# EAGLE design jnode_v34 (EAGLE 6.6.0)
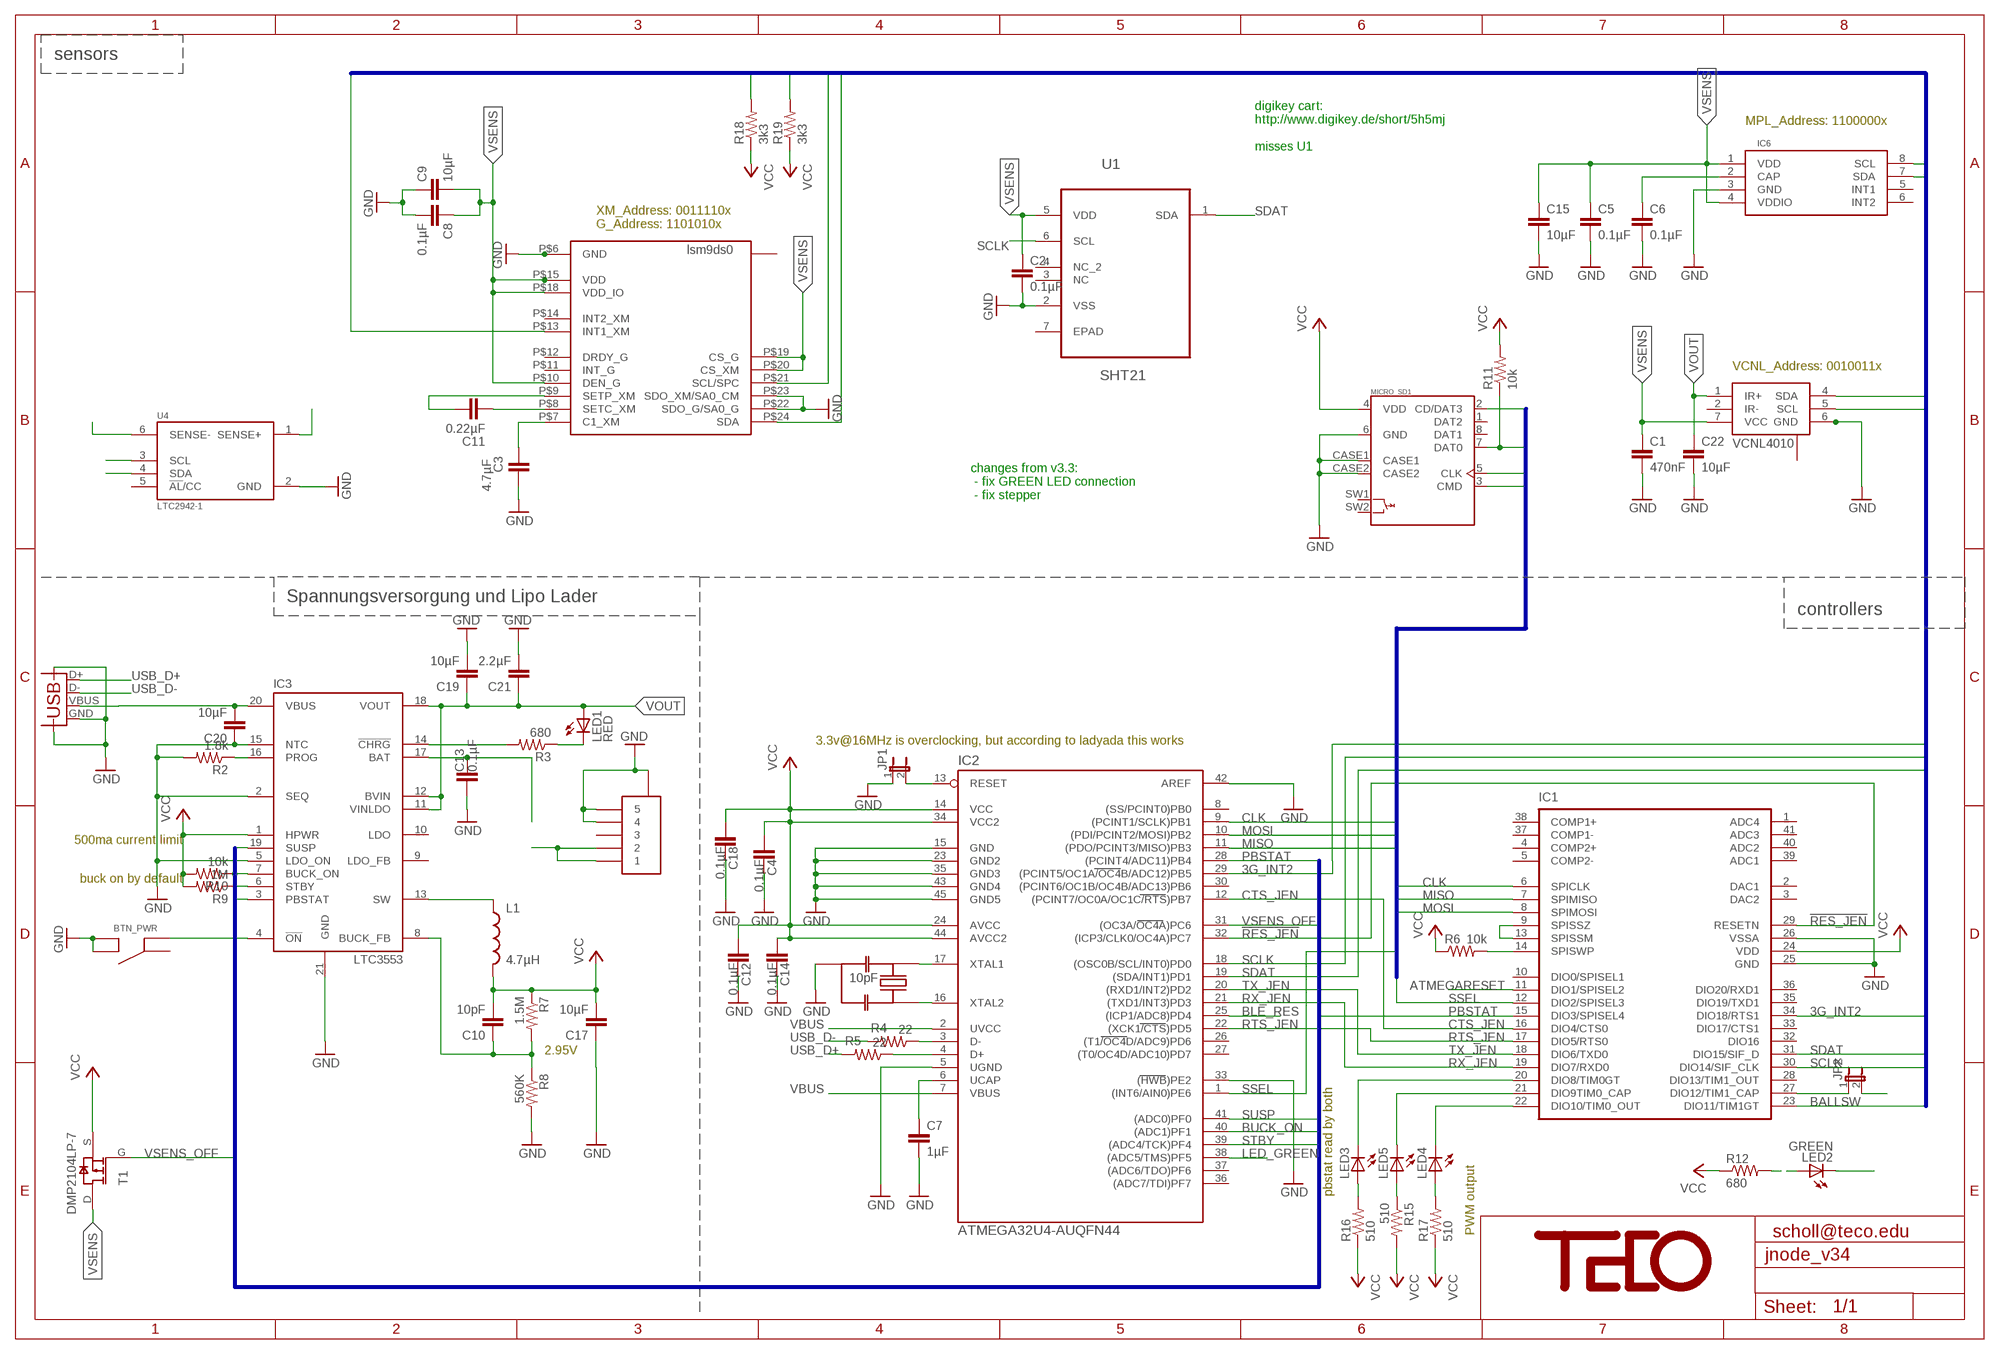
[diagram p0: schematic, sheet 1]

## Parts
BTN_PWR  TACTILE_SWITCH  [EVQ-PUK02K]
C1  470nF  CAP0402-CAP  [0402-CAP]
C2  0.1µF  CAP0402-CAP  [0402-CAP]
C3  4.7µF  CAP0402-CAP  [0402-CAP]
C4  0.1µF  CAP0402-CAP  [0402-CAP]
C5  0.1µF  CAP0402-CAP  [0402-CAP]
C6  0.1µF  CAP0402-CAP  [0402-CAP]
C7  1µF  CAP0402-CAP  [0402-CAP]
C8  0.1µF  CAP0402-CAP  [0402-CAP]
C9  10µF  CAP0603-CAP  [0603-CAP]
C10  10pF  CAP0402-CAP  [0402-CAP]
C11  0.22µF  CAP0402-CAP  [0402-CAP]
C12  0.1µF  CAP0402-CAP  [0402-CAP]
C13  0.1µF  CAP0402-CAP  [0402-CAP]
C14  0.1µF  CAP0402-CAP  [0402-CAP]
C15  10µF  CAP0603-CAP  [0603-CAP]
C17  10µF  CAP0603-CAP  [0603-CAP]
C18  0.1µF  CAP0402-CAP  [0402-CAP]
C19  10µF  CAP0603-CAP  [0603-CAP]
C20  10µF  CAP0603-CAP  [0603-CAP]
C21  2.2µF  CAP0402-CAP  [0402-CAP]
C22  10µF  CAP0603-CAP  [0603-CAP]
IC1  JENNIC_JN51XXSMDTH  [JN5148_SMDTH]
IC2  ATMEGA32U4-AUQFN44  [QFN44]
IC3  LTC3553  [QFN20]
IC6  MPL3115A2  [LGA8]
JP1  JUMPER-2SMD-NO  [SJ_2S-NO]
JP2  JUMPER-2SMD-NC  [SJ_2S]
L1  4.7µH  SPARKFUN_INDUCTOR  [MLP2012]
LED1  RED  LEDCHIP-LED0402  [CHIP-LED0402]
LED2  GREEN  LEDCHIP-LED0402  [CHIP-LED0402]
LED3  LEDGL100MD1MP1  [GL100MD1MP1]
LED4  LEDGL100MD1MP1  [GL100MD1MP1]
LED5  LEDGL100MD1MP1  [GL100MD1MP1]
MICRO_SD1  MOLEX_47309-2651NEW  [MOLEX_47309-2651]
R2  1.8k  RESISTOR0402-RES  [0402-RES]
R3  680  RESISTOR0402-RES  [0402-RES]
R4  22  RESISTOR0402-RES  [0402-RES]
R5  22  RESISTOR0402-RES  [0402-RES]
R6  10k  RESISTOR0402-RES  [0402-RES]
R7  1.5M  RESISTOR0402-RES  [0402-RES]
R8  560K  RESISTOR0402-RES  [0402-RES]
R9  1M  RESISTOR0402-RES  [0402-RES]
R10  10k  RESISTOR0402-RES  [0402-RES]
R11  10k  RESISTOR0402-RES  [0402-RES]
R12  680  RESISTOR0402-RES  [0402-RES]
R15  510  RESISTOR0402-RES  [0402-RES]
R16  510  RESISTOR0402-RES  [0402-RES]
R17  510  RESISTOR0402-RES  [0402-RES]
R18  3k3  RESISTOR0402-RES  [0402-RES]
R19  3k3  RESISTOR0402-RES  [0402-RES]
T1  DMP2104LP-7  [DFN1411-3]
U1  SHT21  [DFN300X300X110-7N]
U2  LSM9D  [LGA4X4]
U3  SFV5R  [SFV5R]
U4  LTC2942-1  [DFN6]
U6  RESONATORPRQC-S  [PRQC]
U$9  TECO-LOGO  [TECO-LOGO]
VCNL4010  VCNL4000  [VNCL4000]
X1  USBMICROB-XT  [USB-MICROB-XT]

## Nets
3G_INT2: IC1.34(DIO18/RTS1) IC2.29((PCINT5/OC1A/OC4B/ADC12)PB5) U2.P$13(INT1_XM)
!RES_JEN: IC1.29(RESETN) IC2.32((ICP3/CLK0/OC4A)PC7)
ATMEGARESET: IC1.11(DIO1/SPISEL2) IC2.13(RESET) JP1.2
BALLSW: IC1.23(DIO11/TIM1GT)
BLE_RES: IC2.25((ICP1/ADC8)PD4)
BUCK_FB: C10.1 IC3.8(BUCK_FB) R7.2 R8.1
BUCK_ON: IC2.40((ADC1)PF1) IC3.7(BUCK_ON) R10.1
CLK: IC1.6(SPICLK) IC2.9((PCINT1/SCLK)PB1) MICRO_SD1.5(CLK)
CTS_JEN: IC1.16(DIO4/CTS0) IC2.12((PCINT7/OC0A/OC1C/RTS)PB7)
GND: BTN_PWR.2(B) BTN_PWR.4(B) C1.2 C2.2 C3.2 C4.1 C5.2 C6.2 C7.2 C8.2 C9.1 C12.1 C13.2 C14.1 C15.2 C17.1 C18.1 C19.2 C20.1 C21.2 C22.2 IC1.25(GND) IC1.26(VSSA) IC2.5(UGND) IC2.15(GND) IC2.23(GND2) IC2.33((HWB)PE2) IC2.35(GND3) IC2.42(AREF) IC2.43(GND4) IC2.45(GND5) IC3.2(SEQ) IC3.5(LDO_ON) IC3.15(NTC) IC3.21(GND) IC6.3(GND) JP1.1 MICRO_SD1.6(GND) MICRO_SD1.CASE1 MICRO_SD1.CASE2 R2.2 R8.2 U1.2(VSS) U2.P$5(GND) U2.P$6(GND) U2.P$22(SDO_G/SA0_G) U2.P$23(SDO_XM/SA0_CM) U3.P$4 U3.P$5 U3.P$6 U3.P$7 U4.2(GND) U6.GND VCNL4010.6(GND) VCNL4010.12(GND) X1.GND X1.GND@2(CASE) X1.GND@3(CASE)
LED_GREEN: IC2.38((ADC5/TMS)PF5) LED2.P$2(C)
MISO: IC1.7(SPIMISO) IC2.11((PDO/PCINT3/MISO)PB3) MICRO_SD1.7(DAT0) R11.1
MOSI: IC1.8(SPIMOSI) IC2.10((PDI/PCINT2/MOSI)PB2) MICRO_SD1.3(CMD)
N$1: IC2.3(D-) R4.1
N$2: C3.1 U2.P$7(C1_XM)
N$3: IC2.4(D+) R5.1
N$4: C7.1 IC2.6(UCAP)
N$5: IC3.16(PROG) R2.1
N$6: VCNL4010.2(IR-) VCNL4010.3(IR-)
N$7: C11.2 U2.P$8(SETC_XM)
N$8: C11.1 U2.P$9(SETP_XM)
N$9: BTN_PWR.3(A) IC3.4(!ON)
N$10: C6.1 IC6.2(CAP)
N$11: LED1.P$2(C) R3.1
N$12: IC3.14(!CHRG) R3.2
N$13: IC1.9(SPISSZ) IC1.13(SPISSM)
N$14: IC1.14(SPISWP) R6.2
N$16: IC2.17(XTAL1) U6.2
N$17: IC2.16(XTAL2) U6.1
N$18: IC1.27(DIO12/TIM1_CAP) JP2.1
N$29: LED2.P$1(A) R12.2
N$30: IC1.21(DIO9TIM0_CAP) LED5.2(C)
N$31: IC1.20(DIO8/TIM0GT) LED3.2(C)
N$32: LED3.1(A) R16.2
N$33: LED5.1(A) R15.1
N$34: IC1.22(DIO10/TIM0_OUT) LED4.2(C)
N$35: LED4.1(A) R17.2
PBSTAT: IC1.15(DIO3/SPISEL4) IC2.28((PCINT4/ADC11)PB4) IC3.3(PBSTAT)
RTS_JEN: IC1.17(DIO5/RTS0) IC2.22((XCK1/CTS)PD5)
RX_JEN: IC1.19(DIO7/RXD0) IC2.21((TXD1/INT3)PD3)
SCLK: IC1.30(DIO14/SIF_CLK) IC2.18((OSC0B/SCL/INT0)PD0) IC6.8(SCL) R19.2 U1.6(SCL) U2.P$21(SCL/SPC) U4.3(SCL) VCNL4010.5(SCL)
SDAT: IC1.31(DIO15/SIF_D) IC2.19((SDA/INT1)PD1) IC6.7(SDA) R18.2 U1.1(SDA) U2.P$24(SDA) U4.4(SDA) VCNL4010.4(SDA)
SENSE+: C13.1 IC3.17(BAT) U4.1(SENSE+)
SENSE-: JP2.2 U3.P$1 U3.P$2 U4.6(SENSE-)
SSEL: IC1.12(DIO2/SPISEL3) IC2.1((INT6/AIN0)PE6) MICRO_SD1.2(CD/DAT3)
STBY: IC2.39((ADC4/TCK)PF4) IC3.6(STBY) R9.1
SUSP: IC2.41((ADC0)PF0) IC3.19(SUSP)
SW: IC3.13(SW) L1.P$1
TX_JEN: IC1.18(DIO6/TXD0) IC2.20((RXD1/INT2)PD2)
USB_D+: R5.2 X1.D+
USB_D-: R4.2 X1.D-
VBUS: C20.2 IC2.2(UVCC) IC2.7(VBUS) IC3.20(VBUS) X1.VBUS
VCC: C4.2 C10.2 C12.2 C14.2 C17.2 C18.2 IC1.24(VDD) IC2.14(VCC) IC2.24(AVCC) IC2.34(VCC2) IC2.44(AVCC2) IC3.1(HPWR) L1.P$2 MICRO_SD1.4(VDD) R6.1 R7.1 R9.2 R10.2 R11.2 R12.1 R15.2 R16.1 R17.1 R18.1 R19.1 T1.S
VOUT: C19.1 C21.1 C22.1 IC3.11(VINLDO) IC3.12(BVIN) IC3.18(VOUT) LED1.P$1(A) VCNL4010.1(IR+)
VSENS: C1.1 C2.1 C5.1 C8.1 C9.2 C15.1 IC6.1(VDD) IC6.4(VDDIO) T1.D U1.5(VDD) U2.P$10(DEN_G) U2.P$15(VDD) U2.P$16(VDD) U2.P$17(VDD) U2.P$18(VDD_IO) U2.P$19(CS_G) U2.P$20(CS_XM) VCNL4010.7(VCC)
VSENS_OFF: IC2.31((OC3A/OC4A)PC6) T1.G
Unconnected: BTN_PWR.1(A) IC1.1(ADC4) IC1.2(DAC1) IC1.3(DAC2) IC1.4(COMP2+) IC1.5(COMP2-) IC1.10(DIO0/SPISEL1) IC1.28(DIO13/TIM1_OUT) IC1.32(DIO16) IC1.33(DIO17/CTS1) IC1.35(DIO19/TXD1) IC1.36(DIO20/RXD1) IC1.37(COMP1-) IC1.38(COMP1+) IC1.39(ADC1) IC1.40(ADC2) IC1.41(ADC3) IC2.8((SS/PCINT0)PB0) IC2.26((T1/OC4D/ADC9)PD6) IC2.27((T0/OC4D/ADC10)PD7) IC2.30((PCINT6/OC1B/OC4B/ADC13)PB6) IC2.36((ADC7/TDI)PF7) IC2.37((ADC6/TDO)PF6) IC3.9(LDO_FB) IC3.10(LDO) IC6.5(INT1) IC6.6(INT2) MICRO_SD1.1(DAT2) MICRO_SD1.8(DAT1) MICRO_SD1.SW1 MICRO_SD1.SW2 U1.3(NC) U1.4(NC_2) U1.7(EPAD) U2.P$1(RES) U2.P$2(RES) U2.P$3(RES) U2.P$4(RES) U2.P$11(INT_G) U2.P$12(DRDY_G) U2.P$14(INT2_XM) U3.P$3 U4.5(!AL!/CC) VCNL4010.8(NC) VCNL4010.9(NC) VCNL4010.10(NC) VCNL4010.11(NC)

## Buses
PWRCTRL:BUCK_ON,STBY,PBSTAT,SUSP,VSENS_OFF
SPI:SSEL,MISO,MOSI,CLK
I2C:SCLK,SDAT,BALLSW,3G_INT2

## Notes on the sheet
- sensors
- MPL_Address: 1100000x
- digikey cart:
  http://www.digikey.de/short/5h5mj
  
  misses U1
- XM_Address: 0011110x
  G_Address: 1101010x
- VCNL_Address: 0010011x
- changes from v3.3:
   - fix GREEN LED connection
   - fix stepper
- Spannungsversorgung und Lipo Lader
- controllers
- 3.3v@16MHz is overclocking, but according to ladyada this works
- 500ma current limit
- buck on by default
- 10pF
- 2.95V
- pbstat read by both
- PWM output | scholl@teco.edu

## Library data of the parts
BTN_PWR = jnode:TACTILE_SWITCH: collection of tactile switches; DIGIKEY: P10852SCT-ND
C1 = sparkfun:CAP: Capacitor Standard 0603 ceramic capacitor, and 0.1" leaded capacitor.; DIGIKEY: 587-1230-1-ND
C2 C5 C6 C8 C12 C14 = sparkfun:CAP: Capacitor Standard 0603 ceramic capacitor, and 0.1" leaded capacitor.; DIGIKEY: 490-1318-1-ND
C3 = sparkfun:CAP: Capacitor Standard 0603 ceramic capacitor, and 0.1" leaded capacitor.; DIGIKEY: 1276-1056-1-ND
C4 C13 C18 = sparkfun:CAP: Capacitor Standard 0603 ceramic capacitor, and 0.1" leaded capacitor.; DIGIKEY: 490-1318-1-ND; PLACE: no
C7 = sparkfun:CAP: Capacitor Standard 0603 ceramic capacitor, and 0.1" leaded capacitor.; DIGIKEY: 490-1320-1-ND
C9 C15 C17 C19 C20 C22 = sparkfun:CAP: Capacitor Standard 0603 ceramic capacitor, and 0.1" leaded capacitor.; DIGIKEY: 445-7454-1-ND
C10 = sparkfun:CAP: Capacitor Standard 0603 ceramic capacitor, and 0.1" leaded capacitor.; DIGIKEY: 311-1014-1-ND
C11 = sparkfun:CAP: Capacitor Standard 0603 ceramic capacitor, and 0.1" leaded capacitor.; DIGIKEY: 399-4886-1-ND
C21 = sparkfun:CAP: Capacitor Standard 0603 ceramic capacitor, and 0.1" leaded capacitor.; DIGIKEY: 445-7396-1-ND
IC1 = jnode:JENNIC_JN51XX: JN5139-xxx-M00xxx, Farnell: 1500175; DIGIKEY: 616-1045-1-ND; PLACE: no
IC2 = jnode:ATMEGA32U4-AU; DIGIKEY: ATMEGA32U4-MU-ND
IC3 = jnode:LTC3553; DIGIKEY: LTC3553EUD#PBF-ND
IC6 = jnode_v33:MPL3115A2; DIGIKEY: MPL3115A2-ND
JP1 = sparkfun:JUMPER-2: Jumper Basic 0.1" spaced jumper. Use with breakaway headers.; PLACE: no
JP2 = SparkFun-Passives:JUMPER-2: Jumper Basic 0.1" spaced jumper. Use with breakaway headers.
L1 = jnode:SPARKFUN_INDUCTOR: Inductors Basic Inductor/Choke - 0603 and 1206. Footprints are not proven and vary greatly between part numbers.; DIGIKEY: 445-6366-1-ND
LED1 = jnode:LED: LED OSRAM: - CHIPLED LG R971, LG N971, LY N971, LG Q971, LY Q971, LO R971, LY R971 LH N974, LH R974 LS Q976, LO Q976, LY Q976 LO Q996 - Hyper CHIPLED LW Q18S LB Q993, LB Q99A, LB R99A - SideLED LS A670, LO A670, LY A670, LG A670, LP A670 LB A673, LV A673, LT A673, LW A673 LH A674 LY A675 LS A676, LA A676, LO A676, LY A676, LW A676 LS A679, LY A679, LG A679 - Hyper Micro SIDELED� LS Y876, LA Y876, LO Y876, LY Y876 LT Y87S - SmartLED LW L88C, LW L88S LB L89C, LB L89S, LG L890 LS L89K, LO L89K, LY L89K LS L896, LA L896, LO L896, LY L896 - TOPLED LS T670, LO T670, LY T670, LG T670, LP T670 LSG T670, LSP T670, LSY T670, LOP T670, LYG T670 LG T671, LOG T671, LSG T671 LB T673, LV T673, LT T673, LW T673 LH T674 LS T676, LA T676, LO T676, LY T676, LB T676, LH T676, LSB T676, LW T676 LB T67C, LV T67C, LT T67C, LS T67K, LO T67K, LY T67K, LW E67C LS E67B, LA E67B, LO E67B, LY E67B, LB E67C, LV E67C, LT E67C LW T67C LS T679, LY T679, LG T679 LS T770, LO T770, LY T770, LG T770, LP T770 LB T773, LV T773, LT T773, LW T773 LH T774 LS E675, LA E675, LY E675, LS T675 LS T776, LA T776, LO T776, LY T776, LB T776 LHGB T686 LT T68C, LB T68C - Hyper Mini TOPLED� LB M676 - Mini TOPLED Santana� LG M470 LS M47K, LO M47K, LY M47K Source: http://www.osram.convergy.de LUXEON: - LUMILED� LXK2-PW12-R00, LXK2-PW12-S00, LXK2-PW14-U00, LXK2-PW14-V00 LXK2-PM12-R00, LXK2-PM12-S00, LXK2-PM14-U00 LXK2-PE12-Q00, LXK2-PE12-R00, LXK2-PE12-S00, LXK2-PE14-T00, LXK2-PE14-U00 LXK2-PB12-K00, LXK2-PB12-L00, LXK2-PB12-M00, LXK2-PB14-N00, LXK2-PB14-P00, LXK2-PB14-Q00 LXK2-PR12-L00, LXK2-PR12-M00, LXK2-PR14-Q00, LXK2-PR14-R00 LXK2-PD12-Q00, LXK2-PD12-R00, LXK2-PD12-S00 LXK2-PH12-R00, LXK2-PH12-S00 LXK2-PL12-P00, LXK2-PL12-Q00, LXK2-PL12-R00 Source: www.luxeon.com KINGBRIGHT: KA-3528ASYC Source: www.kingbright.com; DIGIKEY: 754-1128-1-ND
LED2 = jnode:LED: LED OSRAM: - CHIPLED LG R971, LG N971, LY N971, LG Q971, LY Q971, LO R971, LY R971 LH N974, LH R974 LS Q976, LO Q976, LY Q976 LO Q996 - Hyper CHIPLED LW Q18S LB Q993, LB Q99A, LB R99A - SideLED LS A670, LO A670, LY A670, LG A670, LP A670 LB A673, LV A673, LT A673, LW A673 LH A674 LY A675 LS A676, LA A676, LO A676, LY A676, LW A676 LS A679, LY A679, LG A679 - Hyper Micro SIDELED� LS Y876, LA Y876, LO Y876, LY Y876 LT Y87S - SmartLED LW L88C, LW L88S LB L89C, LB L89S, LG L890 LS L89K, LO L89K, LY L89K LS L896, LA L896, LO L896, LY L896 - TOPLED LS T670, LO T670, LY T670, LG T670, LP T670 LSG T670, LSP T670, LSY T670, LOP T670, LYG T670 LG T671, LOG T671, LSG T671 LB T673, LV T673, LT T673, LW T673 LH T674 LS T676, LA T676, LO T676, LY T676, LB T676, LH T676, LSB T676, LW T676 LB T67C, LV T67C, LT T67C, LS T67K, LO T67K, LY T67K, LW E67C LS E67B, LA E67B, LO E67B, LY E67B, LB E67C, LV E67C, LT E67C LW T67C LS T679, LY T679, LG T679 LS T770, LO T770, LY T770, LG T770, LP T770 LB T773, LV T773, LT T773, LW T773 LH T774 LS E675, LA E675, LY E675, LS T675 LS T776, LA T776, LO T776, LY T776, LB T776 LHGB T686 LT T68C, LB T68C - Hyper Mini TOPLED� LB M676 - Mini TOPLED Santana� LG M470 LS M47K, LO M47K, LY M47K Source: http://www.osram.convergy.de LUXEON: - LUMILED� LXK2-PW12-R00, LXK2-PW12-S00, LXK2-PW14-U00, LXK2-PW14-V00 LXK2-PM12-R00, LXK2-PM12-S00, LXK2-PM14-U00 LXK2-PE12-Q00, LXK2-PE12-R00, LXK2-PE12-S00, LXK2-PE14-T00, LXK2-PE14-U00 LXK2-PB12-K00, LXK2-PB12-L00, LXK2-PB12-M00, LXK2-PB14-N00, LXK2-PB14-P00, LXK2-PB14-Q00 LXK2-PR12-L00, LXK2-PR12-M00, LXK2-PR14-Q00, LXK2-PR14-R00 LXK2-PD12-Q00, LXK2-PD12-R00, LXK2-PD12-S00 LXK2-PH12-R00, LXK2-PH12-S00 LXK2-PL12-P00, LXK2-PL12-Q00, LXK2-PL12-R00 Source: www.luxeon.com KINGBRIGHT: KA-3528ASYC Source: www.kingbright.com; DIGIKEY: 754-1127-1-ND
LED3-LED5 = jnode:LED: LED OSRAM: - CHIPLED LG R971, LG N971, LY N971, LG Q971, LY Q971, LO R971, LY R971 LH N974, LH R974 LS Q976, LO Q976, LY Q976 LO Q996 - Hyper CHIPLED LW Q18S LB Q993, LB Q99A, LB R99A - SideLED LS A670, LO A670, LY A670, LG A670, LP A670 LB A673, LV A673, LT A673, LW A673 LH A674 LY A675 LS A676, LA A676, LO A676, LY A676, LW A676 LS A679, LY A679, LG A679 - Hyper Micro SIDELED� LS Y876, LA Y876, LO Y876, LY Y876 LT Y87S - SmartLED LW L88C, LW L88S LB L89C, LB L89S, LG L890 LS L89K, LO L89K, LY L89K LS L896, LA L896, LO L896, LY L896 - TOPLED LS T670, LO T670, LY T670, LG T670, LP T670 LSG T670, LSP T670, LSY T670, LOP T670, LYG T670 LG T671, LOG T671, LSG T671 LB T673, LV T673, LT T673, LW T673 LH T674 LS T676, LA T676, LO T676, LY T676, LB T676, LH T676, LSB T676, LW T676 LB T67C, LV T67C, LT T67C, LS T67K, LO T67K, LY T67K, LW E67C LS E67B, LA E67B, LO E67B, LY E67B, LB E67C, LV E67C, LT E67C LW T67C LS T679, LY T679, LG T679 LS T770, LO T770, LY T770, LG T770, LP T770 LB T773, LV T773, LT T773, LW T773 LH T774 LS E675, LA E675, LY E675, LS T675 LS T776, LA T776, LO T776, LY T776, LB T776 LHGB T686 LT T68C, LB T68C - Hyper Mini TOPLED� LB M676 - Mini TOPLED Santana� LG M470 LS M47K, LO M47K, LY M47K Source: http://www.osram.convergy.de LUXEON: - LUMILED� LXK2-PW12-R00, LXK2-PW12-S00, LXK2-PW14-U00, LXK2-PW14-V00 LXK2-PM12-R00, LXK2-PM12-S00, LXK2-PM14-U00 LXK2-PE12-Q00, LXK2-PE12-R00, LXK2-PE12-S00, LXK2-PE14-T00, LXK2-PE14-U00 LXK2-PB12-K00, LXK2-PB12-L00, LXK2-PB12-M00, LXK2-PB14-N00, LXK2-PB14-P00, LXK2-PB14-Q00 LXK2-PR12-L00, LXK2-PR12-M00, LXK2-PR14-Q00, LXK2-PR14-R00 LXK2-PD12-Q00, LXK2-PD12-R00, LXK2-PD12-S00 LXK2-PH12-R00, LXK2-PH12-S00 LXK2-PL12-P00, LXK2-PL12-Q00, LXK2-PL12-R00 Source: www.luxeon.com KINGBRIGHT: KA-3528ASYC Source: www.kingbright.com; FARNELL: http://de.farnell.com/sharp/gl100md1mp1/ir-emitter-smd-940nm/dp/9707816?Ntt=970-7816; PLACE: no
MICRO_SD1 = jnode_v33:MOLEX_47309-2651; DIGIKEY: WM3974CT-ND
R2 = sparkfun:RESISTOR: Resistor Basic schematic elements and footprints for 0603, 1206, and PTH 1/10th watt (small) resistors.; DIGIKEY: 311-1.8KJRCT-ND
R3 R12 = sparkfun:RESISTOR: Resistor Basic schematic elements and footprints for 0603, 1206, and PTH 1/10th watt (small) resistors.; DIGIKEY: RHM680CDCT-ND
R4 R5 = sparkfun:RESISTOR: Resistor Basic schematic elements and footprints for 0603, 1206, and PTH 1/10th watt (small) resistors.; DIGIKEY: 311-22JRCT-ND
R6 R10 R11 = sparkfun:RESISTOR: Resistor Basic schematic elements and footprints for 0603, 1206, and PTH 1/10th watt (small) resistors.; DIGIKEY: RHM10.0KCDCT-ND
R7 = sparkfun:RESISTOR: Resistor Basic schematic elements and footprints for 0603, 1206, and PTH 1/10th watt (small) resistors.; DIGIKEY: 311-1.5MJRCT-ND
R8 = sparkfun:RESISTOR: Resistor Basic schematic elements and footprints for 0603, 1206, and PTH 1/10th watt (small) resistors.; DIGIKEY: P560KLCT-ND
R9 = sparkfun:RESISTOR: Resistor Basic schematic elements and footprints for 0603, 1206, and PTH 1/10th watt (small) resistors.; DIGIKEY: 311-1.00MLRCT-ND
R15-R17 = sparkfun:RESISTOR: Resistor Basic schematic elements and footprints for 0603, 1206, and PTH 1/10th watt (small) resistors.; PLACE: no
R18 R19 = sparkfun:RESISTOR: Resistor Basic schematic elements and footprints for 0603, 1206, and PTH 1/10th watt (small) resistors.; DIGIKEY: 1276-3460-1-ND
T1 = jnode:DMP2104LP; DIGIKEY: DMP2104LPDICT-ND
U1 = jnode_v33:SHT21: SENSOR, HUMIDITY & TEMP; FARNELL: http://de.farnell.com/sensirion/sht21/sensor-feuchte-temp-3x3mm-2/dp/1855468?Ntt=1855468
U2 = jnode:LSM9D; ARROW: http://components.arrow.com/part/search/lsm9ds0; DIGIKEY: http://www.digikey.com/product-detail/en/LSM9DS0TR/497-13902-1-ND/4311634; MOUSER: http://de.mouser.com/ProductDetail/STMicroelectronics/LSM9DS0TR/?qs=sGAEpiMZZMuKDbbCTfAPp11kUrUmzV%2fUUlya6JDFJEo%3d
U3 = jnode:SFV5R; DIGIKEY: 609-4330-1-ND
U4 = PowerBoard.rpt:LTC2942: LTC2942-1/2 Linear Technology Battery Gas Gauge with Temperature, Voltage Measurement, 6-pin DFN 2x3mm Source: http://cds.linear.com/docs/Datasheet/29421f.pdf http://cds.linear.com/docs/Datasheet/2942fa.pdf; DIGIKEY: LTC2942IDCB-1#TRMPBFCT-ND
U6 = jnode:RESONATOR: Ceramic Resonator with caps AWSCR-16.00CV-T: 16Mhz ceramic resonator with 22pF capacitors PRQC16.00SR5010X000: 16Mhz ceramic resonator with 10pF capacitors; DIGIKEY: 478-5420-1-ND
U$9 = teco_div:TECO-LOGO; PLACE: no
VCNL4010 = VCNL4000:VCNL4000; DIGIKEY: VCNL4010-GS08CT-ND
X1 = sparkfun:USB: USB Connectors USB-B-PTH is fully proven SKU : PRT-00139 USB-miniB is fully proven SKU : PRT-00587 USB-A-PCB is untested. USB-A-H is throughly reviewed, but untested. Spark Fun Electronics SKU : PRT-00437 USB-B-SMT is throughly reviewed, but untested. Needs silkscreen touching up. USB-A-S has not been used/tested USB-MB-H has not been used/tested; DIGIKEY: H11635CT-ND

## Board
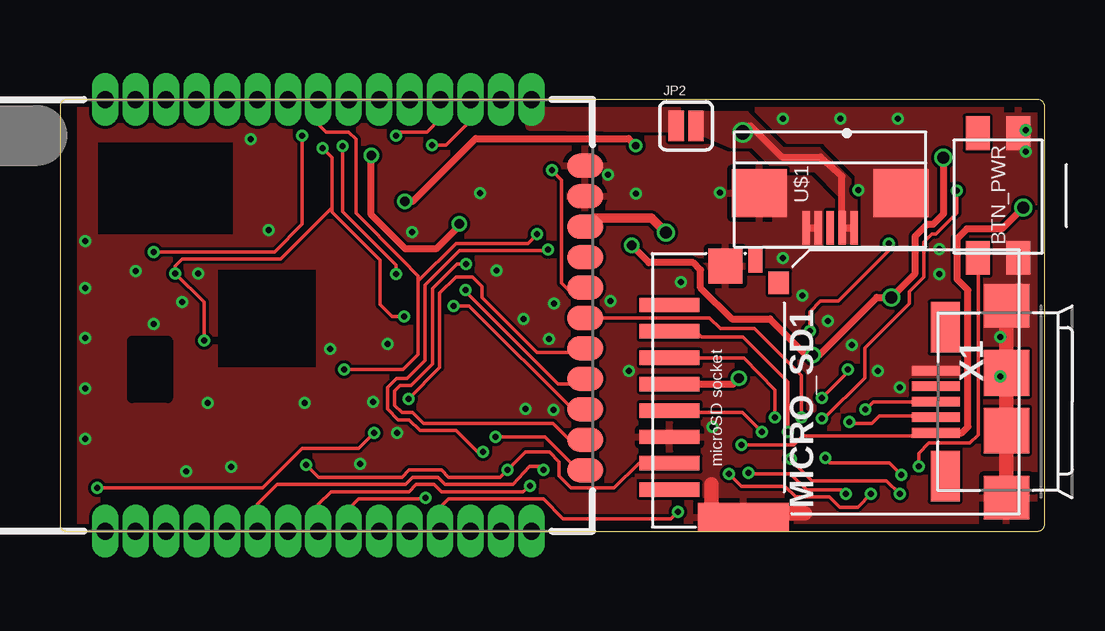
[diagram p1: board, top side]
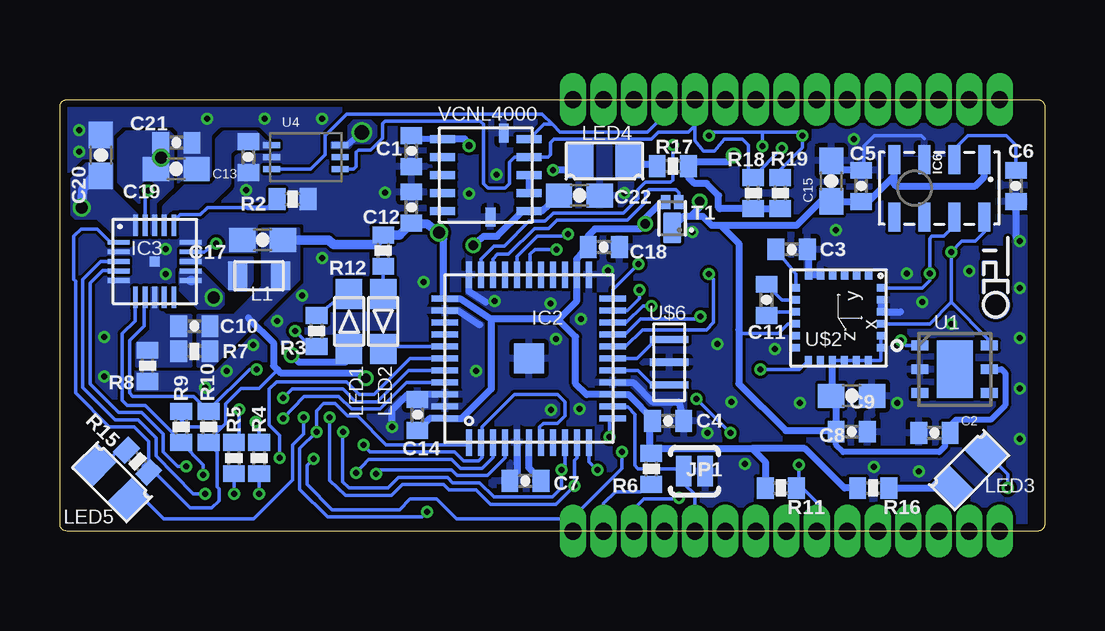
[diagram p2: board, bottom side, seen from below]

Size 41.05 x 18 mm. Coordinates in mm from the lower left corner, seen from the top.
Outline: 0.3,18 arc88 0,17.7 0,0.3 arc92 0.3,0 40.75,0 arc90 41.05,0.3 41.05,17.7 arc90 40.75,18 0.3,18
Copper layers (1*16): Top 0.035mm / dielectric 1.5mm / Bottom 0.035mm
Design rules "PCB-POOL HighSpec *": minimum track width 0.125mm, minimum drill 0.2mm, track to track 0.125mm, track to pad 0.125mm, pad to pad 0.125mm, via to via 0.125mm, smd to smd 0.125mm, copper to edge 0.3mm, drill to drill 0.2mm, minimum pad ring 0.2mm, minimum via ring 0.125mm, stop-mask expansion 0.0005mm, vias tented up to drill 0mil, thermal gap 0.2mm
tRestrict: area 6.6,6.8 to 10.7,10.9; area 3,5.5 to 4.5,8; area 1.8,12.6 to 7,16.1; area 1.6,12.4 to 7.2,16.2
bRestrict: area 6.6,6.8 to 10.7,10.9; area 2,12.9 to 6.7,15.6

### Footprints (pad centres in the part's own frame; a part is rotated, then mirrored left to right if it is on the bottom)
EVQ-PUK02K = smd 1.4 x 1: 1 5,2.5; 2 5,0.8; 3 -0.2,2.5; 4 -0.2,0.8
0402-CAP = smd 0.7 x 0.9: 1 -0.65,0; 2 0.65,0
0603-CAP = smd 1.1 x 1: 1 -0.85,0; 2 0.85,0
JN5148_SMDTH = drill 0.7 pad 1.016 long: 1 -8.9,9.32; 2 -8.9,8.05; 3 -8.9,6.78; 4 -8.9,5.51; 5 -8.9,4.24; 6 -8.9,2.97; 7 -8.9,1.7; 8 -8.9,0.43; 9 -8.9,-0.84; 10 -8.9,-2.11; 11 -8.9,-3.38; 12 -8.9,-4.65; 13 -8.9,-5.92; 14 -8.9,-7.19; 15 -8.9,-8.46; 27 9.1,-8.46; 28 9.1,-7.19; 29 9.1,-5.92; 30 9.1,-4.65; 31 9.1,-3.38; 32 9.1,-2.11; 33 9.1,-0.84; 34 9.1,0.43; 35 9.1,1.7; 36 9.1,2.97; 37 9.1,4.24; 38 9.1,5.51; 39 9.1,6.78; 40 9.1,8.05; 41 9.1,9.32 | smd 1 x 1.5: 16 -6.36,-10.69; 17 -5.09,-10.69; 18 -3.82,-10.69; 19 -2.55,-10.69; 20 -1.28,-10.69; 21 -0.01,-10.69; 22 1.26,-10.69; 23 2.53,-10.69; 24 3.8,-10.69; 25 5.07,-10.69; 26 6.34,-10.69
QFN44 = smd 1.1 x 0.25: 1 -3.5,2.5; 2 -3.5,2; 3 -3.5,1.5; 4 -3.5,1; 5 -3.5,0.5; 6 -3.5,0; 7 -3.5,-0.5; 8 -3.5,-1; 9 -3.5,-1.5; 10 -3.5,-2; 11 -3.5,-2.5; 23 3.5,-2.5; 24 3.5,-2; 25 3.5,-1.5; 26 3.5,-1; 27 3.5,-0.5; 28 3.5,0; 29 3.5,0.5; 30 3.5,1; 31 3.5,1.5; 32 3.5,2; 33 3.5,2.5 | smd 0.25 x 1.1: 12 -2.5,-3.5; 13 -2,-3.5; 14 -1.5,-3.5; 15 -1,-3.5; 16 -0.5,-3.5; 17 0,-3.5; 18 0.5,-3.5; 19 1,-3.5; 20 1.5,-3.5; 21 2,-3.5; 22 2.5,-3.5; 34 2.5,3.5; 35 2,3.5; 36 1.5,3.5; 37 1,3.5; 38 0.5,3.5; 39 0,3.5; 40 -0.5,3.5; 41 -1,3.5; 42 -1.5,3.5; 43 -2,3.5; 44 -2.5,3.5 | smd 1.25 x 1.25: 45 0,0
QFN20 = smd 0.9 x 0.2: 1 -1.5,0.8; 2 -1.5,0.4; 3 -1.5,0; 4 -1.5,-0.4; 5 -1.5,-0.8; 11 1.5,-0.8; 12 1.5,-0.4; 13 1.5,0; 14 1.5,0.4; 15 1.5,0.8 | smd 0.2 x 0.9: 6 -0.8,-1.5; 7 -0.4,-1.5; 8 0,-1.5; 9 0.4,-1.5; 10 0.8,-1.5; 16 0.8,1.5; 17 0.4,1.5; 18 0,1.5; 19 -0.4,1.5; 20 -0.8,1.5 | smd 0.42 x 0.42: 21 0,0
LGA8 = smd 1.2 x 0.5: 1 -1.2,1.875; 2 -1.2,0.625; 3 -1.2,-0.625; 4 -1.2,-1.875; 5 1.2,-1.875; 6 1.2,-0.625; 7 1.2,0.625; 8 1.2,1.875
SJ_2S-NO = smd 0.635 x 1.27: 1 -0.45,0; 2 0.45,0
SJ_2S = smd 0.635 x 1.27: 1 -0.412,0; 2 0.412,0
MLP2012 = smd 0.8 x 1.2: P$1 0.9,0; P$2 -0.9,0
CHIP-LED0402 = smd 1.25 x 1.1: P$1 -0.15,0; P$2 2.15,0
GL100MD1MP1 = smd 1.1 x 1.4: 1 -1,0; 2 1,0
MOLEX_47309-2651 = smd 0.6 x 2.5: 1 3.43,2.385; 2 2.33,2.385; 3 1.23,2.385; 4 0.13,2.385; 5 -0.97,2.385; 6 -2.07,2.385; 7 -3.17,2.385; 8 -4.27,2.385 | smd 1.2 x 3.79: CASE1 -5.42,-0.695 | smd 1.45 x 1.4: CASE2 5.055,0.06 | smd 1 x 0.6: SW1 5.28,-1.19 | smd 0.95 x 0.85: SW2 4.355,-2.165
0402-RES = smd 0.7 x 0.9: 1 -0.65,0; 2 0.65,0
DFN1411-3 = smd 1.25 x 0.75: D -0.4,0 | smd 0.6 x 0.4: G 0.675,-0.275; S 0.675,0.275
DFN300X300X110-7N = smd 0.711 x 0.406: 1 -1.448,0.991; 2 -1.448,0; 3 -1.448,-0.991; 4 1.448,-0.991; 5 1.448,0; 6 1.448,0.991 | smd 1.499 x 2.388: 7 0,0
LGA4X4 = smd 0.35 x 0.3: P$1 -1.775,1.255; P$2 -1.775,0.755; P$3 -1.775,0.255; P$4 -1.775,-0.245; P$5 -1.775,-0.745; P$6 -1.775,-1.245; P$13 1.775,-1.25; P$14 1.775,-0.75; P$15 1.775,-0.25; P$16 1.775,0.25; P$17 1.775,0.75; P$18 1.775,1.25 | smd 0.3 x 0.35: P$7 -1.25,-1.775; P$8 -0.75,-1.775; P$9 -0.25,-1.775; P$10 0.25,-1.775; P$11 0.75,-1.775; P$12 1.25,-1.775; P$19 1.25,1.775; P$20 0.75,1.775; P$21 0.25,1.775; P$22 -0.25,1.775; P$23 -0.75,1.775; P$24 -1.25,1.775
SFV5R = smd 0.3 x 1.4: P$1 0.5,0; P$2 1,0; P$3 1.5,0; P$4 2,0; P$5 2.5,0 | smd 2.3 x 2: P$6 -1.45,-1.45; P$7 4.45,-1.45
DFN6 = smd 0.7 x 0.25: 1 -1.425,0.5; 2 -1.425,0; 3 -1.425,-0.5; 4 1.425,-0.5; 5 1.425,0; 6 1.425,0.5
PRQC = smd 0.3 x 1.6: 1 -0.95,0; 2 0.95,0; GND 0,0
VNCL4000 = smd 0.35 x 1.05: 1 -1.5,-1.8; 2 -0.75,-1.8; 3 0,-1.8; 4 0.75,-1.8; 5 1.5,-1.8; 7 1.5,1.8; 8 0.75,1.8; 9 0,1.8; 10 -0.75,1.8; 11 -1.5,1.8 | smd 0.805 x 0.4: 6 1.75,-0.75; 12 -1.75,-0.2
USB-MICROB-XT = smd 0.4 x 2: D+ 0,3.1; D- -0.65,3.1; GND 1.3,3.1; ID 0.65,3.1; VBUS -1.3,3.1 | smd 1.8 x 1.9: GND@2 -4,0.15; GND@3 4,0.15 | smd 1.9 x 1.9: XT1 -1.2,0.15; XT2 1.2,0.15 | smd 2.1 x 1.2: XT3 3.1,2.7; XT4 -3.1,2.7

### Placement (x,y rotation side)
BTN_PWR  40.75,11.6 90 top
C1  26.4,15.85 270 bottom
C2  4.6,4.1 180 bottom
C3  10.55,11.75 0 bottom
C4  15.7,4.6 180 bottom
C5  7.65,14.4 90 bottom
C6  1.2,14.4 270 bottom
C7  21.65,2.1 180 bottom
C8  8.05,4.15 0 bottom
C9  8.05,5.65 180 bottom
C10  35.45,8.55 0 bottom
C11  11.6,9.65 90 bottom
C12  26.4,13.5 270 bottom
C13  33.2,15.6 270 bottom
C14  26.15,4.85 270 bottom
C15  8.9,14.6 90 bottom
C17  32.6,12.15 0 bottom
C18  18.38,11.85 180 bottom
C19  36.2,15.1 0 bottom
C20  39.35,15.68 270 bottom
C21  36.2,16.2 0 bottom
C22  19.4,14 0 bottom
IC1  11.2,8.9 90 top
IC2  21.5,7.2 90 bottom
IC3  37.1,11.25 0 bottom
IC6  4.4,14.3 270 bottom
JP1  14.6,2.5 180 bottom
JP2  26.1,16.9 0 top
L1  32.75,10.65 180 bottom
LED1  29,7.75 90 bottom
LED2  27.57,9.75 270 bottom
LED3  3.15,2.55 45 bottom
LED4  18.35,15.43 180 bottom
LED5  38.88,2.05 315 bottom
MICRO_SD1  27.8,6 90 top
R2  31.35,13.85 0 bottom
R3  30.35,8.35 270 bottom
R4  32.75,3.05 90 bottom
R5  33.8,3.05 90 bottom
R6  16.4,2.6 270 bottom
R7  35.45,7.5 180 bottom
R8  37.4,6.9 270 bottom
R9  36,4.35 90 bottom
R10  34.85,4.35 270 bottom
R11  11,1.8 180 bottom
R12  27.57,11.7 270 bottom
R15  37.82,2.92 315 bottom
R16  7.15,1.8 0 bottom
R17  15.5,15.22 180 bottom
R18  12.15,14.1 90 bottom
R19  11.03,14.1 90 bottom
T1  15.53,13.05 90 bottom
U1  3.75,6.75 0 bottom
U2  8.6,8.9 270 bottom
U3  33.6,12.65 180 top
U4  30.8,15.6 0 bottom
U6  15.65,7.05 90 bottom
U$9  2.05,10.2 270 bottom
VCNL4010  23.3,14.85 90 bottom
X1  39.6,5.4 90 top

### Tracks (layer width: path | path; a pad name or v marks a point on that pad's centre or on a via)
3G_INT2  (via drill 0.25)
  Top 0.15: 14.93,10.43 14.93,7.38 14.3,6.75 v11.85,6.75 | 14.93,10.43 16.5,12 19.5,12 v19.88,12.4 | IC1.34 10.77,16.98 11.1,16.65 12.03,16.65 12.35,16.35 12.35,13.28 14.25,11.32 14.93,10.65 14.93,10.43
  Bottom 0.15: v19.88,12.4 19.98,12.3 21.15,12.3 22,11.45 IC2.29 | U2.P$13 10.22,6.75 v11.85,6.75
!RES_JEN  (via drill 0.25)
  Top 0.15: v15.5,16.1 16.1,16.1 17.12,17.12 IC1.29
  Bottom 0.15: IC2.32 23.5,11.35 22.95,11.9 22.52,11.9 21.5,12.93 20.82,12.93 20.48,13.28 17.55,13.28 16.95,13.88 16.95,14.25 16.65,14.55 15.6,14.55 15.5,14.65 v15.5,16.1
ATMEGARESET
  Bottom 0.15: IC2.13 17.9,5.17 17.38,5.17 17.07,4.88 17.07,2.75 17,2.65 16.95,2.6 15.15,2.6 arc90 JP1.2 15.05,2 14.58,1.53 IC1.11
BALLSW
  Top 0.15: 22.08,11.43 IC1.23
BUCK_FB
  pour Bottom (no thermals): 36.95,10.12 36.95,9.3 36.65,9 35.6,9 35.6,6.9 37.85,6.9 37.85,7.8 37.25,8.4 37.25,10.12
BUCK_ON  (via drill 0.25)
  Top 0.15: v31.75,5.55 32.85,6.65 v32.85,6.75
  Bottom 0.15: IC3.7 37.55,9.7 37.55,8.55 38.15,7.95 38.15,5.78 38.02,5.62 35.48,5.62 R10.1 34.85,5.05 33.15,6.75 v32.85,6.75 | IC2.40 26.52,6.7 27.82,5.4 28.73,5.4 29.25,5.92 31.38,5.92 v31.75,5.55
CLK  (via drill 0.25)
  Top 0.15: MICRO_SD1.5 25.7,4.95 28.45,4.95 v29.25,4.15 | v20.15,2.55 20,2.7 19.57,2.7 18.88,1.95 16.05,1.95 15.75,2.25 14.7,2.25 14.4,1.95 9.05,1.95 8.23,1.13 IC1.6
  Bottom 0.15: v29.25,4.15 29.25,4.05 29.27,4.03 29.27,2.05 29,1.8 27.38,1.8 26.93,2.25 24.9,2.25 24.68,2.02 23.55,2.02 22.95,1.43 20.52,1.43 20.15,1.8 v20.15,2.55 20,2.7 IC2.9
CTS_JEN  (via drill 0.25)
  Top 0.15: IC1.16 21.61,2.54 20.23,3.92 v18.15,3.92
  Bottom 0.15: v18.15,3.92 18.15,4.55 IC2.12
GND  (via drill 0.25)
  Top 0.15: MICRO_SD1.CASE1 30.88,0.58 31.05,0.75
  Top 0.305: U3.P$4 U3.P$5
  Top 0.6: X1.GND@2 X1.GND@3 | 31.05,0.75 27.15,0.75 27.15,1.95
  Bottom 0.15: 5.03,16.38 5.15,16.5 7.1,16.5 7.55,16.05 7.55,15.15 C5.2 7.55,14.9
  Bottom 0.3: C5.2 8.5,15.05 | IC2.42 26.15,5.7 | 26.15,5.7 C14.1 | IC2.35 24.45,9.2 23.55,8.6 | IC2.5 22,2.4 C7.2 | IC2.15 17.15,6.2 16.35,5.4 15.25,5.4 C4.1 | v27.2,4.35 27.2,5.05 26.55,5.7 26.15,5.7 | 23.3,9.55 24,10 IC2.33 | U2.P$5 U2.P$6 9.85,11.7 C3.2 | U2.P$23 U2.P$22 6,9.15 | C6.2 1.2,12.25 v1.05,12.1
  other vias: 39.2,8.1 39.2,6.45 40.25,16.73 36.65,10.72 36.65,11.78 40.25,15.82 34.1,6.67 30.95,9.82 30.12,11.4 32,8.78 33,7.78 35,6 20.57,5.05 19.4,5.1 19.32,8.85 23.71,6.67 12.5,2.8 17.51,14.1 20.6,9.5 14.68,12.47 13.05,5.4 18.2,10.88 24,14.07 25.89,10.4 20.38,8.03 14.05,4.1 7.12,2.67 13.65,7.8 5.75,10.75 1.05,3.85 7.95,16.35 8.7,12.55 27.5,14.12 1.05,5.95 1.05,8.05 1.05,10.15 6.15,5.35 3.15,10.85 3.9,8.65 10.2,5.35 5.25,2.5 11.25,7.6 5.1,9.55 30.12,17.2 32.52,17.2 34.92,17.2 33.28,14.22 22.85,14.86 22.94,9.59
  pour Bottom (rank 3, no thermals): 29.75,10.65 29.75,17.4 40.85,17.4 40.85,5.7 34.7,5.7
  pour Top (rank 3, no thermals): 29.75,10.65 29.75,17.4 40.85,17.4 40.85,5.7 34.7,5.7
  pour Top (rank 4): 0.8,0 0.8,18.15 41,18.15 41,0
  pour Bottom (rank 4): 0.8,0 0.8,18.15 41,18.15 41,0
LED_GREEN
  Bottom 0.15: IC2.38 27.48,7.7 LED2.P$2
MISO  (via drill 0.25)
  Top 0.15: v10.25,2.77 10.78,2.25 14.25,2.25 14.55,2.55 15.9,2.55 16.2,2.25 18.35,2.25 v18.65,2.55 19.4,3.3 20.4,3.3 20.8,2.9 20.8,2.3 21.3,1.8 23.1,1.8 24.13,2.83 MICRO_SD1.7
  Bottom 0.15: 19.05,3.25 IC2.11 19,2.9 v18.65,2.55 | R11.1 10.25,1.95 | 10.25,1.95 v10.25,2.77 | 10.25,1.95 9.5,1.2 IC1.7
MOSI  (via drill 0.25)
  Top 0.15: MICRO_SD1.3 28.52,7.23 29.8,5.9 v29.8,4.75 | v19.6,1.9 19.3,1.65 15.9,1.65 15.6,1.95 14.85,1.95 14.55,1.65 11.3,1.65 10.77,1.12 IC1.8
  Bottom 0.15: IC2.10 19.5,3.05 19.6,2.95 v19.6,1.9 20.38,1.12 23.1,1.12 23.7,1.73 24.82,1.73 25.05,1.95 26.77,1.95 27.23,1.5 29.15,1.5 29.8,2.12 v29.8,4.75
N$1  (via drill 0.25)
  Top 0.15: v32.75,1.55 32.58,1.73 31.12,1.73 30.45,2.4 28.73,2.4 v28.7,2.42
  Bottom 0.15: IC2.3 23,3.08 23.45,2.62 24.35,2.62 24.73,3 28.18,3 v28.7,2.42 | R4.1 v32.75,1.55
N$2
  Bottom 0.15: U2.P$7 10.38,10.72 C3.1
N$3  (via drill 0.25)
  Top 0.15: v33.8,1.55 33.25,1 32.5,1 32.08,1.43 30.68,1.43 30.23,1.88 28.4,1.88 v27.88,2.4
  Bottom 0.15: IC2.4 22.5,3.05 23.23,2.33 24.5,2.33 24.73,2.55 27.75,2.55 v27.88,2.4 | v33.8,1.55 R5.1
N$4
  Bottom 0.3: IC2.6 21.5,2.65 C7.1
N$5
  Bottom 0.15: IC3.16 36.3,12.95 36.05,13.2 35.2,13.2 34.9,13.5 33.25,13.5
  Bottom 0.2: 33.25,13.5 32.35,13.5 R2.1
N$6
  Bottom 0.3: VCNL4010.3 VCNL4010.2
N$7
  Bottom 0.15: U2.P$8 10.95,9.65 C11.2
N$8
  Bottom 0.15: U2.P$9 11.6,9.15 C11.1
N$9  (via drill 0.25)
  Top 0.15: v35.8,2.7 35.8,3.25 36.23,3.67 37.92,3.67 38.27,4.03 38.27,11.07 38.25,11.1 BTN_PWR.3
  Bottom 0.15: IC3.4 38.58,10.88 39.27,10.88 39.8,10.35 39.8,6.15 38.6,4.95 37.65,4.95 36.75,4.05 36.75,3.3 36.15,2.7 v35.8,2.7
N$10
  Bottom 0.15: C6.1 1.2,16.1 1.6,16.5 3.2,16.5 3.77,15.93 IC6.2
N$11
  Bottom 0.15: LED1.P$2 29.05,10 R3.1
N$12  (via drill 0.25)
  Top 0.15: v31.25,8.35 31.25,9.15 31.7,9.6 32.45,9.6 34.55,11.7 v34.55,12
  Bottom 0.15: IC3.14 35.05,11.65 v34.55,12 | R3.2 30.6,7.7 v31.25,8.35
N$13  (via drill 0.25)
  Top 0.15: v15.24,1.38 15.15,1.35 12.45,1.35 12,0.9 12,0.04 IC1.9
  Bottom 0.15: IC1.13 17.12,0.93 16.7,1.35 15.3,1.35 v15.24,1.38
N$14
  Bottom 0.15: R6.2 16.5,2 16.85,1.65 17.9,1.65 18.39,1.16 IC1.14
N$16
  Bottom 0.15: IC2.17 17,7.2 16.25,7.95 16.15,7.95 U6.2
N$17
  Bottom 0.15: IC2.16 16.95,6.7 16.4,6.15 15.7,6.15 U6.1
N$18
  pour Top (no thermals): 25.7,16.8 19.6,16.9 19.6,17.6 25.7,17.6
N$29
  Bottom 0.15: LED2.P$1 R12.2
N$30  (via drill 0.25)
  Top 0.15: v30.9,4.75 30.9,6.5 28.95,8.45 27.52,8.45 27.07,8.9 22.12,8.9 21.93,8.65 IC1.21
  Bottom 0.15: LED5.2 37.9,1.65 37.85,1.65 36.73,0.53 32.98,0.53 31.35,2.15 31.35,3.6 30.9,4.05 v30.9,4.75
N$31  (via drill 0.25)
  Top 0.15: v1.55,1.8 8.45,1.8 10.1,3.45 12.45,3.45 v13.1,4.1 | IC1.20 21.75,7.5 21.7,7.46 19.89,7.46 17.6,9.75 17.6,10.2 17.2,10.6 16.5,10.6 15.82,9.93 15.82,6.83 v14.53,5.53
  Bottom 0.15: LED3.2 1.55,2.36 v1.55,1.8 | v14.53,5.53 v13.1,4.1
N$32
  Bottom 0.3: R16.2 3.95,1.8 LED3.1
N$33
  Bottom 0.15: LED5.1 39.23,2.77 38.55,3.45 R15.1
N$34  (via drill 0.25)
  Top 0.15: v20.5,15.05 20.9,14.65 20.9,10.35 21.18,10.07 IC1.22
  Bottom 0.15: LED4.2 19.5,15.05
  Bottom 0.3: 19.5,15.05 v20.5,15.05
N$35
  Bottom 0.3: LED4.1 17.55,15.3 16.23,15.3 R17.2
PBSTAT  (via drill 0.25)
  Top 0.15: v20.35,11.75 20.25,11.7 16.65,11.7 15.22,10.28 15.22,7.12 14.47,6.38 14.03,6.38 13.65,6 13.65,5.1 14.1,4.65 14.55,4.65 15,4.2 16.5,4.2 17.4,3.3 v17.62,3.3 | v30.48,3.02 30.48,2.98 31.35,2.1 34.45,2.1 v35,1.55
  Bottom 0.15: IC3.3 39.35,11.25 40.1,10.5 40.1,6 38.75,4.65 37.8,4.65 37.05,3.9 37.05,3.15 35.5,1.55 v35,1.55 35.05,1.57 | v30.48,3.02 30.75,2.75 30.75,1.95 29.7,0.9 26.9,0.9 26.45,1.35 25.35,1.35 24.52,0.53 19.73,0.53 | 19.73,0.53 17.62,2.62 v17.62,3.3 | 19.73,0.53 19.73,0.07 IC1.15 | IC2.28 21.45,10.75 21.45,11.55 21.25,11.75 v20.35,11.75
RTS_JEN  (via drill 0.25)
  Top 0.15: v16.93,11.15 16.55,11.15 15.53,10.12 15.53,6.97 14.62,6.08 14.18,6.08 13.95,5.85 13.95,5.25 14.25,4.95 14.7,4.95 15.15,4.5 20.55,4.5 21.24,3.81 IC1.17
  Bottom 0.15: IC2.22 18,10.07 v16.93,11.15
RX_JEN  (via drill 0.25)
  Top 0.15: IC1.19 22.41,6.15 20.75,6.15 16.9,10 v16.9,10.05
  Bottom 0.15: v16.9,10.05 16.9,9.7 17.4,9.2 IC2.21
SCLK  (via drill 0.25)
  Top 0.15: v14,10.72 14,11.1 11.78,13.32 v11.78,16.05 | v14,16.5 14.15,16.65 15.3,16.65 15.85,17.2 IC1.30 | v10.1,16.5 10.1,12.8 8.95,11.65 v3.9,11.65
  Bottom 0.15: IC2.18 17.48,7.7 16.77,8.4 14.1,8.4 13.8,8.7 13.8,10.53 v14,10.72 | v14,16.5 13.85,16.65 11.78,16.65 | 11.78,16.65 10.2,16.65 10.1,16.55 v10.1,16.5 10.1,16 11.03,15.07 R19.2 | IC1.30 15.85,17.35 16.55,16.65 20.2,16.65 20.52,16.98 | v11.78,16.05 11.78,16.65 | 3.9,9.55 4.8,8.65 U2.P$21 | 3.9,9.55 v3.9,11.65 3.45,12.1 2.9,12.1 2.52,12.47 IC6.8 | U1.6 2.3,7.95 3.9,9.55 | 20.52,16.98 20.95,17.4 29.1,17.4 30,16.5 30,15.7 30.6,15.1 U4.3 | VCNL4010.5 20.88,16.98 20.52,16.98
SDAT  (via drill 0.25)
  Top 0.15: v10.95,15.97 11.35,15.57 11.35,13.5 | 11.35,13.5 11.35,13.3 13.35,11.3 13.35,9.45 13.85,8.95 v14.35,8.95 | 11.35,13.5 9.2,11.35 5.1,11.35 4.8,11.05 v4.8,10.75 6,9.55 v6,7.95
  Bottom 0.15: IC2.19 17.5,8.2 16.85,8.85 14.5,8.85 v14.35,8.95 | 21.05,15.6 VCNL4010.4 | 14.58,16.92 14.58,16.28 14.22,15.86 13.78,15.86 13.35,16.35 12.6,16.35 12.35,16.1 12.35,14.9 12.15,14.7 R18.2 12.15,14.78 v10.95,15.97 | 14.58,16.92 IC1.31 | 14.58,16.92 14.85,16.65 16.1,16.65 16.4,16.35 20.45,16.35 20.6,16.2 20.6,15.7 20.7,15.6 VCNL4010.4 | U2.P$24 5.1,10.15 4.8,10.45 v4.8,10.75 4.8,12.2 4.7,12.3 4.2,12.3 3.77,12.72 IC6.7 | U1.1 5.79,7.74 v6,7.95 | VCNL4010.4 22.1,15.6 22.3,15.4 22.3,14.5 22.5,14.3 23.2,14.3 23.4,14.5 23.4,16.97 23.53,17.1 27.5,17.1 27.6,17 27.6,16.4 28.1,15.9 28.6,15.9 28.7,15.8 28.7,15.2 28.8,15.1 U4.4
SENSE+
  pour Bottom (no thermals): 32.9,16.6 34.2,16.6 34.5,16.3 34.5,14.6 34.7,14.4 35.8,14.4 36.7,13.49 36.7,12.39 36.7,12.4 36.7,13.2 36.4,13.5 35.3,13.5 35,13.8 34.7,13.8 34,14.5 34,15.8 33.8,16 32.4,16 32.4,16.2 32.5,16.2
SENSE-  (via drill 0.6)
  Top 0.25: v28.46,16.63 28.46,16.79 28.38,16.88
  Top 0.3: 28.4,16.9 28.8,16.9 30.1,15.6 31.7,15.6 32.6,14.8 U3.P$2
  Top 0.305: U3.P$2 U3.P$1
  Bottom 0.25: U4.6 29.09,16.1 v28.46,16.63
  pour Top (no thermals): 33.1,12.1 32.6,12.1 32.6,14 31.5,15.1 29.9,15.1 28.9,16.1 28,16.1 26.6,16.7 26.5,17.4 28.6,17.4 30.1,15.9 31.6,15.9 33.1,14.4
  pour Bottom (no thermals): 27.9,16.4 27.9,16.9 28.1,17.1 28.8,17.1 29,16.9 29,16.3 29.1,16.2 29.7,16.2 29.7,16 29,16 28.8,16.2 28.1,16.2
SSEL  (via drill 0.25)
  Top 0.15: MICRO_SD1.2 26.5,8.35 26.75,8.11 28.47,8.11 30.35,6.22 v30.35,4.15 | v25.75,0.8 25.48,0.53 20.98,0.53 20.15,1.35 16.2,1.35 15.85,1 IC1.12
  Bottom 0.15: IC2.1 24.05,3.75 24.05,3.6 27.45,3.6 28.65,4.8 29.05,4.8 29.57,5.33 30.05,5.33 30.35,5.03 v30.35,4.15 31.05,3.45 31.05,1.75 29.9,0.6 25.95,0.6 v25.75,0.8
STBY  (via drill 0.25)
  Top 0.15: v35.08,2.35 34.58,2.85 32.1,2.85 v31.9,3.05
  Bottom 0.15: IC3.6 37.92,9.72 37.92,8.78 38.45,8.25 38.45,5.45 38.25,5.25 37.5,5.25 36.15,3.9 R9.1 | 35.9,3.6 R9.1 | v31.9,3.05 31.9,4 32.33,4.42 32.33,5.92 32.02,6.22 29.1,6.22 28.57,5.7 27.95,5.7 26.45,7.2 IC2.39 | R9.1 35.08,2.77 v35.08,2.35
SUSP  (via drill 0.25)
  Top 0.15: v31.75,4.7 31.85,4.7 33.55,6.4 33.55,7.65 35.4,9.5 35.4,10 36,10.6 36,12.05 36.35,12.4 36.5,12.4 37.38,13.28 v37.38,14.2
  Bottom 0.15: IC3.19 37.5,14.1 v37.38,14.2 | IC2.41 26.6,6.2 27.7,5.1 28.9,5.1 29.43,5.62 30.88,5.62 30.9,5.6 v31.75,4.7
SW
  pour Bottom (no thermals): 35.98,11.1 35,11.1 33.95,10.05 33.24,10.05 33.04,10.43 33.05,11.4 35.98,11.4
TX_JEN  (via drill 0.25)
  Top 0.15: IC1.18 22.34,4.95 21.5,4.95 17.05,9.4 v16.4,9.4
  Bottom 0.15: v16.4,9.4 16.75,9.4 17.45,8.7 IC2.20
USB_D+  (via drill 0.25)
  Top 0.15: v33.58,5.08 33.9,5.4 X1.D+
  Bottom 0.15: R5.2 33.95,3.45 33.58,3.83 v33.58,5.08
USB_D-  (via drill 0.25)
  Top 0.15: X1.D- 35.67,4.8 34.15,4.8 33.85,4.5 32.95,4.5 v32.9,4.55
  Bottom 0.15: R4.2 32.75,4.4 v32.9,4.55
VBUS  (via drill 0.25, 0.5)
  Top 0.15: X1.VBUS 35.75,4.1 35.62,3.98 30.98,3.98 30.6,3.6 v28.4,3.6
  Top 0.3: X1.VBUS 37.6,4.1 37.85,4.35 37.85,10.05 37.4,10.5 37.4,12.2 37.8,12.6 39.25,12.6 v40.15,13.5
  Bottom 0.15: IC2.7 21.05,3.75 21.05,4.35 20.9,4.5 20.3,4.5 20,4.8 20,5.4 20.3,5.7 22.1,5.7 23.45,4.35 23.45,3.75 IC2.2 23.45,3.65 23.45,3.08 23.6,2.92 24.23,2.92 24.6,3.3 28.12,3.3 28.38,3.55 v28.4,3.6
  Bottom 0.4: v40.15,13.5 40.1,14.25 39.67,14.82 C20.2
  pour Bottom (no thermals): 37.85,12.38 37.85,13.2 38.9,14.25 38.9,15.3 39.95,15.3 40.55,14.7 40.55,13.2 40.4,13.05 39.5,13.05 38.75,12.38
VCC  (via drill 0.4, 0.5)
  Top 0.3: MICRO_SD1.4 28.05,6.13 v28.3,6.38 | 21.66,12.46 IC1.24 | v12.97,15.68 12.97,13.2 14.4,11.78 15.68,11.78 16.65,12.75 v16.65,12.82
  Top 0.4: 21.69,12.45 IC1.24 22.29,13.05 24.65,13.05 v25.25,12.45
  Bottom 0.15: IC3.1 38.95,12.05 39.5,12.6 40.17,12.6 40.48,12.3 40.48,10.5 40.4,10.43 40.4,5.78 39,4.35 37.95,4.35 37.35,3.75 37.35,2.7 35.62,0.97 34.73,0.97 34.42,1.27 34.42,1.77 34.5,1.85 34.5,3.3 R10.2 34.85,3.95 34.7,3.95 34.3,4.35 | 16.48,4.42 16.45,4.45 C4.2 | R9.2 36,4.65 35.7,4.35 34.3,4.35 | 34.3,4.35 34.15,4.5 34.15,5.3 33.5,5.95 32.75,5.95 31.98,6.72
  Bottom 0.2: IC2.34 25.05,9.75
  Bottom 0.3: C4.2 16.3,4.65 17.35,5.7 IC2.14 19.1,5.7 19.55,6.15 19.55,8.1 20.3,8.85 | C14.2 25.65,4.7 IC2.44 24.3,4.7 23.07,5.92 23.07,8.85 | IC2.34 24.38,9.7 23.07,8.85 | 25.05,9.75 25.05,12.2 v25.25,12.45 | 26.25,12.9 C12.2 | 12.2,3.45 11.65,2.9 R11.2 | 20.3,8.85 23.07,8.85 | 12.2,3.45 16,3.45 R6.1 16.48,3.58 16.48,4.42 | 33.2,8.9 32.15,7.85 32.15,6.9 31.98,6.72 31.85,6.6 28.52,6.6 v28.3,6.38 | 20.3,8.85 20.15,8.95 19.5,9.6 IC2.24 19.5,11.35 19.1,11.85 C18.2 19.02,12.32 18.75,12.6 16.88,12.6 v16.65,12.82 16.65,13.05 15.97,13.72 T1.S | 37.35,2.7 37.51,2.7 R15.2 | R19.1 R18.1 13.55,13.45 13.6,13.5 13.6,14 14.1,14.5 14.6,14.5 14.85,14.75 R17.1 14.68,15.4 13.25,15.4 v12.97,15.68 | R16.1 8.35,1.8 10,3.45 12.2,3.45
  Bottom 0.4: v25.25,12.45 25.75,12.8 C12.2 26.9,12.35 R12.1 27.9,11.95 29.65,11.95 29.85,12.15 31.7,12.15 31.75,12.1 C17.2
  pour Bottom (no thermals): 32.6,12.6 32.6,10.2 33.8,9 35.3,9 35.3,6.9 34.7,6.9 31.1,10.5 31.1,12.6
VOUT  (via drill 0.4, 0.5)
  Top 0.3: v23.82,11.93 24.55,11.2 26.4,11.2 26.7,10.9 26.7,10.15 28,8.85 29.6,8.85 31.1,7.35 v31.4,7.35 31.65,7.35 34.05,9.75 v34.65,9.75 35.65,10.75 35.65,12.3 36.15,12.8 36.4,12.8 36.83,13.22 v36.83,15.57
  Bottom 0.3: v31.4,7.35 31.1,7.05 29.15,7.05 28.9,7.3 LED1.P$1 | C22.1 20.95,13.35 VCNL4010.1 21.77,13.35 22.82,12.3 23.38,12.3 v23.82,11.93
  Bottom 0.4: IC3.11 35.55,10.45
  pour Bottom (no thermals): 37.07,12.38 37.09,13.68 36.38,14.35 36.35,16.5 36.5,16.65 38.3,16.65 38.6,16.35 38.6,14.55 37.55,13.5 37.55,12.75 37.17,12.38
  pour Bottom (rank 2, no thermals): 35.9,10.95 35,10.95 34.25,10.2 34.25,9.45 34.4,9.3 35.3,9.3 36.05,10.05 36.05,10.8
VSENS  (via drill 0.3, 0.4)
  Top 0.3: v14.38,13.75 14.7,13.75 17.32,16.38 23.7,16.38 v24,16.07
  Bottom 0.15: U2.P$20 U2.P$19 6.83,7.12 U2.P$18 U2.P$17 U2.P$16 U2.P$15 | U2.P$10 10.7,8.65 11.1,8.25 12.6,8.25 12.75,8.4
  Bottom 0.25: U1.5 1.8,6.75 1.65,6.6 1.65,5.25 2.25,4.65 3.7,4.65 | 4.15,3.55 4.4,3.3 8.4,3.3 8.7,3.6 C8.1 | VCNL4010.7 26.25,16.35 arc90 C1.1
  Bottom 0.254: 4.15,3.55 4.15,3.9 C2.1 3.95,4.4 3.7,4.65
  Bottom 0.3: v14.38,13.75 14.4,13.72 14.4,13.5 14.78,13.12 | 14.78,13.12 15.05,13.12 T1.D | 14.78,13.12 14.25,13.12 13.88,12.75 13.5,12.75 | 13.5,12.75 10.35,12.75 9.35,13.75 C15.1 C5.1 7.35,13.75 6.28,14.82 IC6.4 6.3,15.47 6.3,14.5 6.2,14.4 2.9,14.4 2.52,14.78 IC6.1 | 13.5,12.75 12.75,12 12.75,8.4 12.75,6.15 10.8,4.2 8.75,4.2 C8.1 8.7,5.45 C9.2 8.85,5.7 U2.P$15 | VCNL4010.7 24.18,16.35 24,16.18 v24,16.07
VSENS_OFF
  Bottom 0.15: IC2.31 23,11.35 22.8,11.55 22.35,11.55 21.27,12.62 20.68,12.62 20.32,12.97 17.4,12.97 16.65,13.72 16.65,14.1 16.5,14.25 15.38,14.25 15.25,14.12 T1.G

### Text on the board
tNames: BTN_PWR | U$1
bNames: VCNL4000 | LED4 | IC3 | L1 | U$6 | IC2 | U$2 | LED2 | LED1 | LED3 | LED5